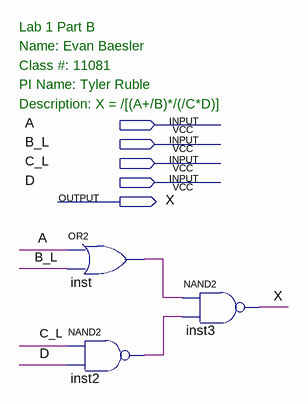
[diagram p0: schematic sheet]
// Quartus schematic lab1b.bdf as structural Verilog: 3 symbols, 5 pins
module lab1b (
  input  A,
  input  B_L,
  input  C_L,
  input  D,
  output X
);

  wire inst2_out, inst_out;

  or inst (inst_out, A, B_L);
  nand inst2 (inst2_out, C_L, D);
  nand inst3 (X, inst_out, inst2_out);

  // Notes on the sheet:
  //   Lab 1 Part B
  //   Name: Evan Baesler
  //   Class #: 11081
  //   PI Name: Tyler Ruble
  //   Description: X = /[(A+/B)*/(/C*D)]
endmodule
